# EAGLE schematic adaptateur_fusible (EAGLE 6.5.0)
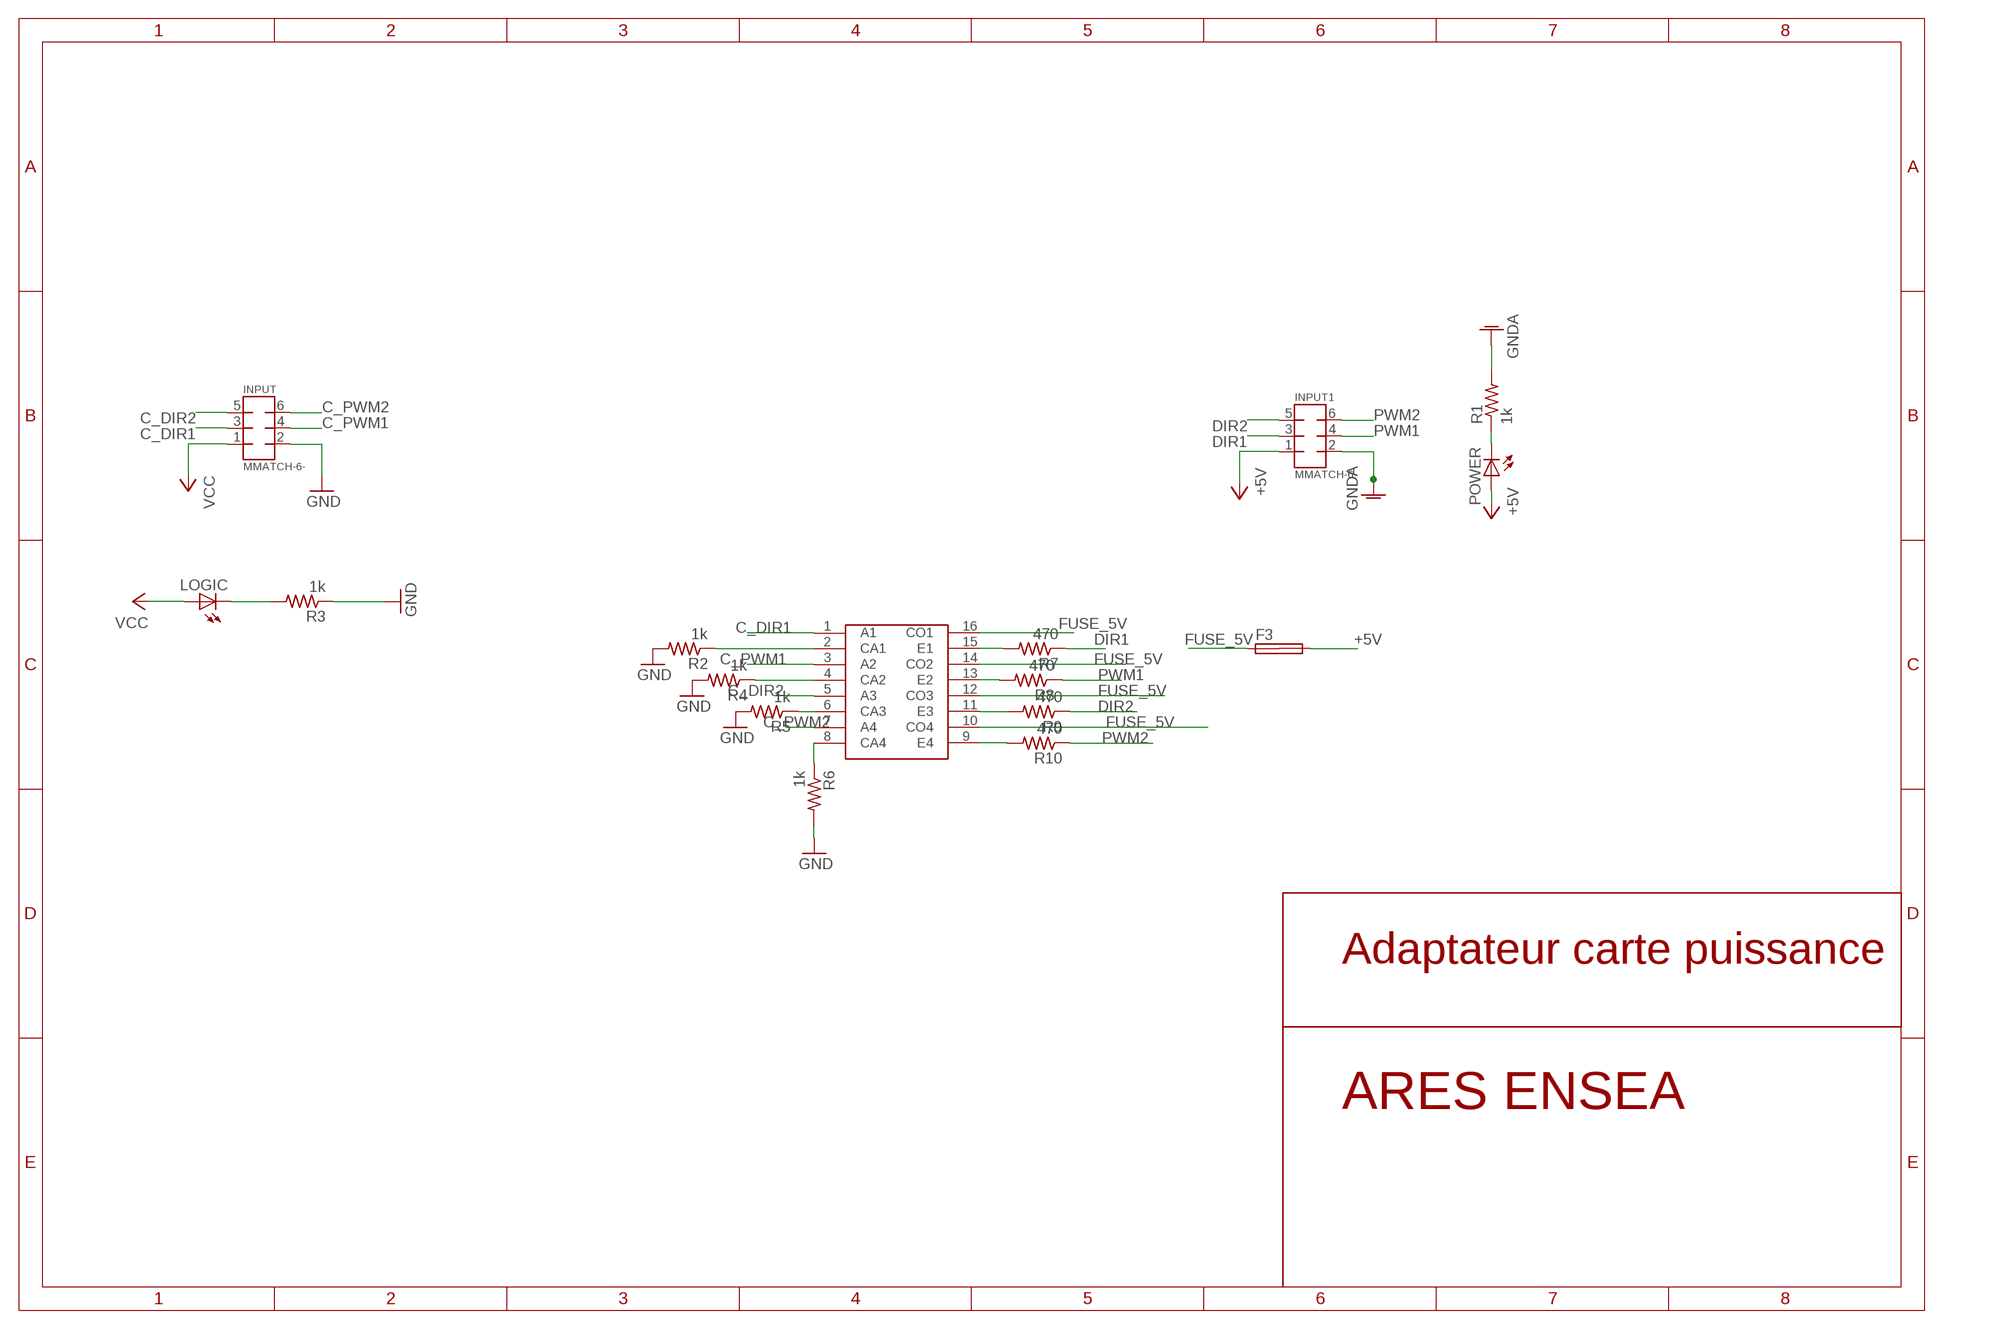
[diagram p0: schematic, sheet 1]

## Parts
F3  SHK20Q  [SHK20Q]
INPUT  MMATCH-6-  [AMP-215079-6]
INPUT1  MMATCH-6-  [AMP-215079-6]
LOGIC  LEDSML0805  [SML0805]
POWER  LEDSML0805  [SML0805]
R1  1k  R-US_M0805  [M0805]
R2  1k  R-US_M0805  [M0805]
R3  1k  R-US_M0805  [M0805]
R4  1k  R-US_M0805  [M0805]
R5  1k  R-US_M0805  [M0805]
R6  1k  R-US_M0805  [M0805]
R7  470  R-US_M0805  [M0805]
R8  470  R-US_M0805  [M0805]
R9  470  R-US_M0805  [M0805]
R10  470  R-US_M0805  [M0805]
U$1  ACPL-244  [ACPL-244]

## Nets
+5V: F3.2A INPUT1.1 POWER.A
C_DIR1: INPUT.3 U$1.1(A1)
C_DIR2: INPUT.5 U$1.5(A3)
C_PWM1: INPUT.4 U$1.3(A2)
C_PWM2: INPUT.6 U$1.7(A4)
DIR1: INPUT1.3 R7.1
DIR2: INPUT1.5 R9.1
FUSE_5V: F3.1A U$1.10(CO4) U$1.12(CO3) U$1.14(CO2) U$1.16(CO1)
GND: INPUT.2 R2.2 R3.1 R4.2 R5.2 R6.2
GNDA: INPUT1.2 R1.2
N$1: R9.2 U$1.11(E3)
N$2: R2.1 U$1.2(CA1)
N$3: POWER.C R1.1
N$4: LOGIC.C R3.2
N$10: R4.1 U$1.4(CA2)
N$11: R5.1 U$1.6(CA3)
N$12: R6.1 U$1.8(CA4)
N$13: R7.2 U$1.15(E1)
N$14: R8.2 U$1.13(E2)
N$16: R10.2 U$1.9(E4)
PWM1: INPUT1.4 R8.1
PWM2: INPUT1.6 R10.1
VCC: INPUT.1 LOGIC.A
Unconnected: F3.1B F3.2B

## Notes on the sheet
- Adaptateur carte puissance
- ARES ENSEA

## Library data of the parts
F3 = fuse:SHK20Q: FUSE HOLDER 5 x 20 mm, SH contact, E1207 Buerklin 64G6061; OC_FARNELL: unknown; OC_NEWARK: unknown
INPUT INPUT1 = jt-con-micromatch:MMATCH-6-*
LOGIC POWER = led:LED: LED OSRAM: - CHIPLED LG R971, LG N971, LY N971, LG Q971, LY Q971, LO R971, LY R971 LH N974, LH R974 LS Q976, LO Q976, LY Q976 LO Q996 - Hyper CHIPLED LW Q18S LB Q993, LB Q99A, LB R99A - SideLED LS A670, LO A670, LY A670, LG A670, LP A670 LB A673, LV A673, LT A673, LW A673 LH A674 LY A675 LS A676, LA A676, LO A676, LY A676, LW A676 LS A679, LY A679, LG A679 - Hyper Micro SIDELED® LS Y876, LA Y876, LO Y876, LY Y876 LT Y87S - SmartLED LW L88C, LW L88S LB L89C, LB L89S, LG L890 LS L89K, LO L89K, LY L89K LS L896, LA L896, LO L896, LY L896 - TOPLED LS T670, LO T670, LY T670, LG T670, LP T670 LSG T670, LSP T670, LSY T670, LOP T670, LYG T670 LG T671, LOG T671, LSG T671 LB T673, LV T673, LT T673, LW T673 LH T674 LS T676, LA T676, LO T676, LY T676, LB T676, LH T676, LSB T676, LW T676 LB T67C, LV T67C, LT T67C, LS T67K, LO T67K, LY T67K, LW E67C LS E67B, LA E67B, LO E67B, LY E67B, LB E67C, LV E67C, LT E67C LW T67C LS T679, LY T679, LG T679 LS T770, LO T770, LY T770, LG T770, LP T770 LB T773, LV T773, LT T773, LW T773 LH T774 LS E675, LA E675, LY E675, LS T675 LS T776, LA T776, LO T776, LY T776, LB T776 LHGB T686 LT T68C, LB T68C - Hyper Mini TOPLED® LB M676 - Mini TOPLED Santana® LG M470 LS M47K, LO M47K, LY M47K Source: http://www.osram.convergy.de LUXEON: - LUMILED® LXK2-PW12-R00, LXK2-PW12-S00, LXK2-PW14-U00, LXK2-PW14-V00 LXK2-PM12-R00, LXK2-PM12-S00, LXK2-PM14-U00 LXK2-PE12-Q00, LXK2-PE12-R00, LXK2-PE12-S00, LXK2-PE14-T00, LXK2-PE14-U00 LXK2-PB12-K00, LXK2-PB12-L00, LXK2-PB12-M00, LXK2-PB14-N00, LXK2-PB14-P00, LXK2-PB14-Q00 LXK2-PR12-L00, LXK2-PR12-M00, LXK2-PR14-Q00, LXK2-PR14-R00 LXK2-PD12-Q00, LXK2-PD12-R00, LXK2-PD12-S00 LXK2-PH12-R00, LXK2-PH12-S00 LXK2-PL12-P00, LXK2-PL12-Q00, LXK2-PL12-R00 Source: www.luxeon.com KINGBRIGHT: KA-3528ASYC Source: www.kingbright.com
R1-R10 = rcl:R-US_: RESISTOR, American symbol
U$1 = acpl-244:ACPL-244